# EAGLE design DMX_Eval_Board (EAGLE 9.6.2)
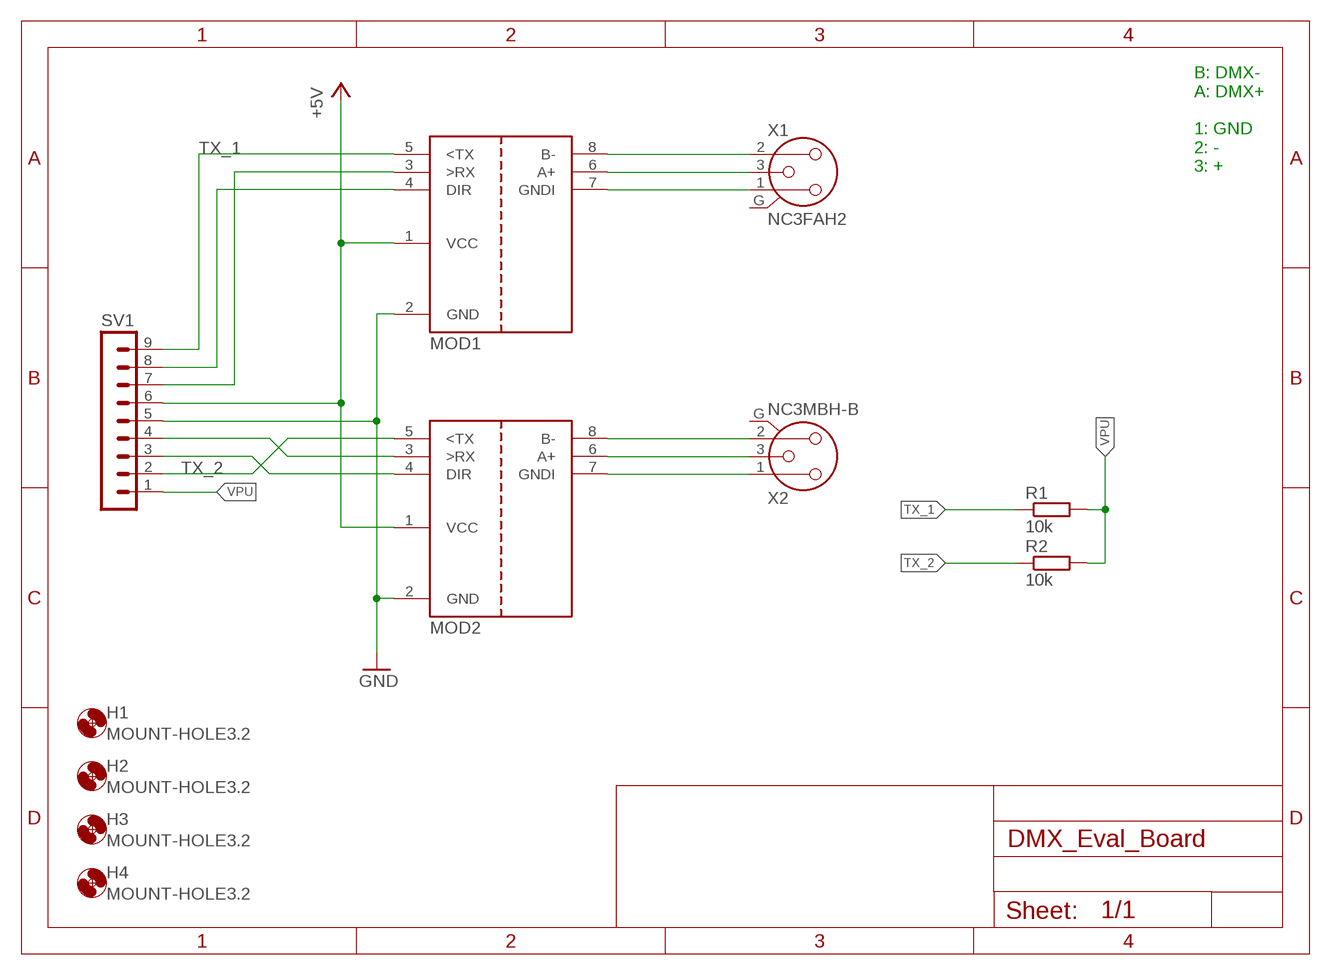
[diagram p0: schematic, sheet 1]

## Parts
H1  MOUNT-HOLE3.2  [3,2]
H2  MOUNT-HOLE3.2  [3,2]
H3  MOUNT-HOLE3.2  [3,2]
H4  MOUNT-HOLE3.2  [3,2]
MOD1  ISOL_DMX_TRANSCEIVER  [MODULE_DMX_ISO]
MOD2  ISOL_DMX_TRANSCEIVER  [MODULE_DMX_ISO]
R1  10k  R-EU_R0603  [R0603]
R2  10k  R-EU_R0603  [R0603]
SV1  MA09-1  [MA09-1]
X1  NC3FAH2  [NC3FAH2]
X2  NC3MBH-B  [NC3MBH-B]

## Nets
+5V: MOD1.1(VCC) MOD2.1(VCC) SV1.6
GND: MOD1.2(GND) MOD2.2(GND) SV1.5
N$1: MOD1.7(GNDI) X1.1
N$2: MOD2.7(GNDI) X2.1
N$3: MOD2.8(B-) X2.2
N$4: MOD2.6(A+) X2.3
N$5: MOD1.6(A+) X1.3
N$6: MOD1.8(B-) X1.2
N$8: MOD2.4(DIR) SV1.3
N$9: MOD2.3(>RX) SV1.4
N$11: MOD1.4(DIR) SV1.8
N$12: MOD1.3(>RX) SV1.7
TX_1: MOD1.5(<TX) R1.1 SV1.9
TX_2: MOD2.5(<TX) R2.1 SV1.2
VPU: R1.2 R2.2 SV1.1
Unconnected: X1.G X2.G

## Notes on the sheet
- B: DMX-
  A: DMX+
  
  1: GND
  2: -
  3: +

## Library data of the parts
H1-H4 = holes:MOUNT-HOLE: MOUNTING HOLE with drill center marker
MOD1 MOD2 = Eigene-Rietig:ISOL_DMX_TRANSCEIVER
R1 R2 = rcl:R-EU_: RESISTOR, European symbol; SPICEPREFIX: R
SV1 = con-lstb:MA09-1: PIN HEADER; OC_FARNELL: unknown; OC_NEWARK: unknown
X1 = con-neutrik_ag:NC3: Neutrik Audio Connector XLR SERIES Stereo 1/4" jack Source: www.neutrik.com/; MPN: NC3FAH2; OC_FARNELL: unknown; OC_NEWARK: 27B4208
X2 = con-neutrik_ag:NC3: Neutrik Audio Connector XLR SERIES Stereo 1/4" jack Source: www.neutrik.com/; MPN: NC3MBH-B; OC_FARNELL: unknown; OC_NEWARK: 27B4288

## Net classes
1 vcc: width 0.254 mm

## Board
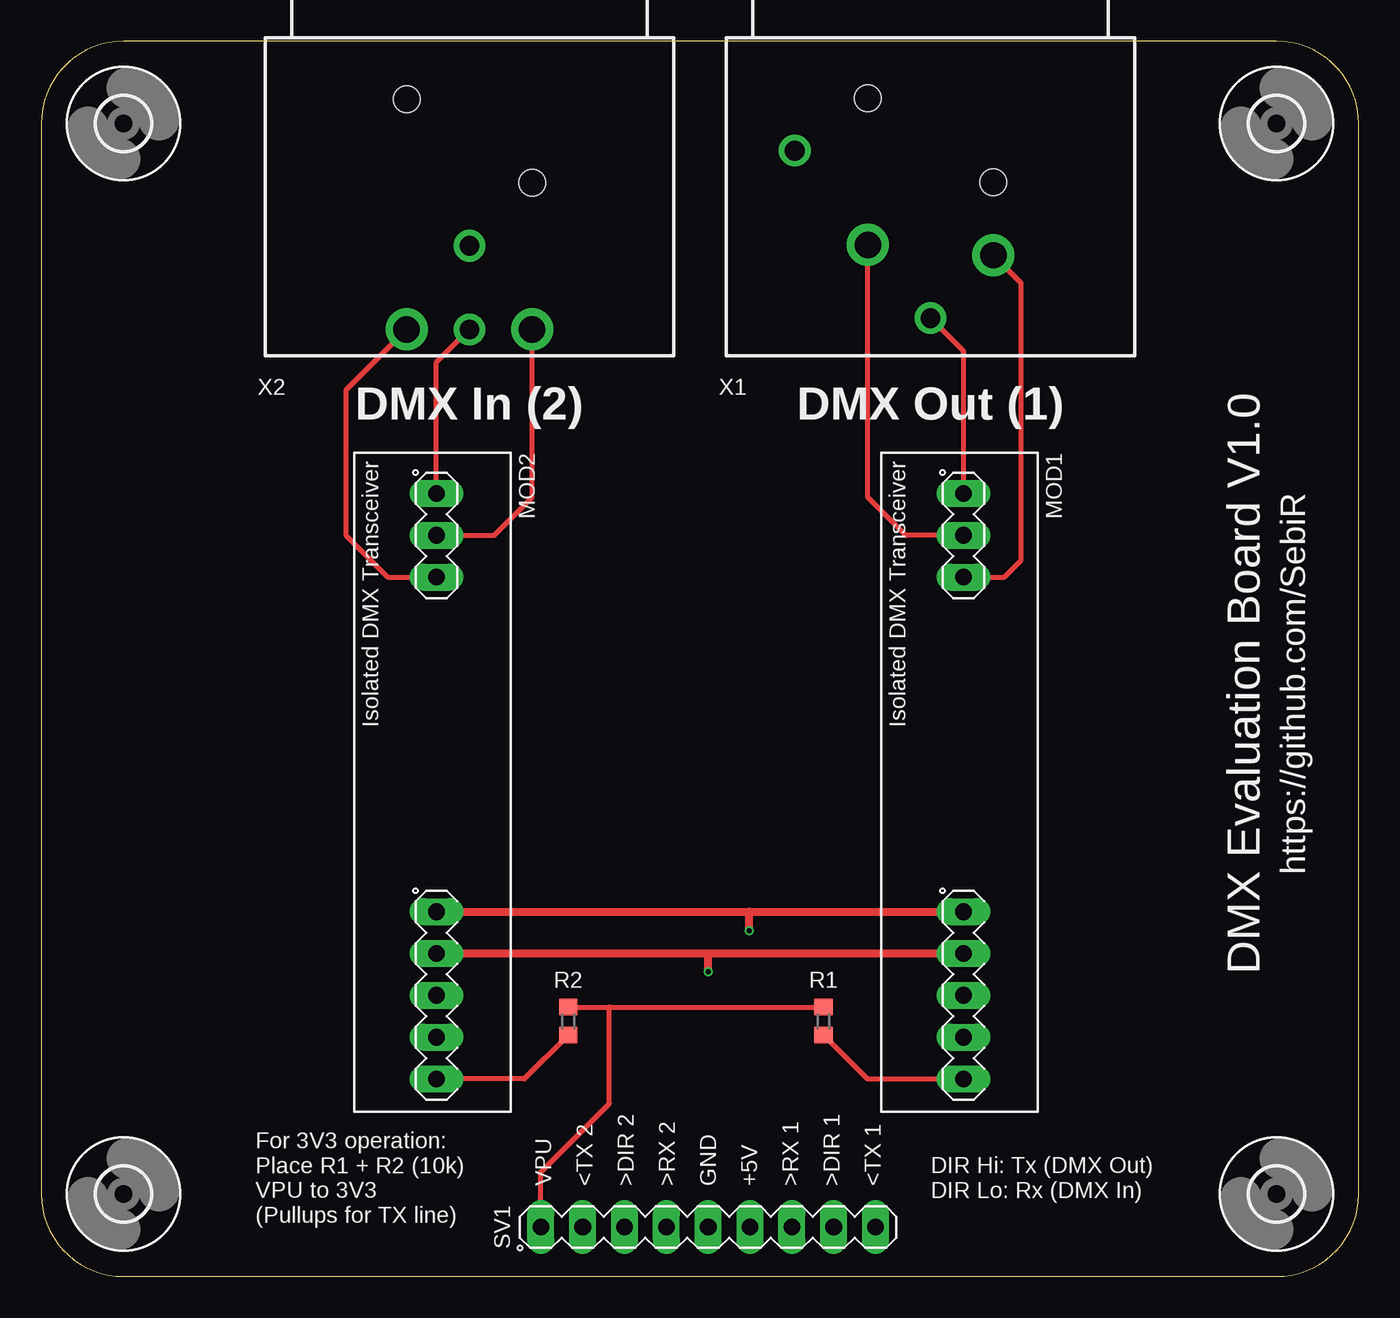
[diagram p1: board, top side]
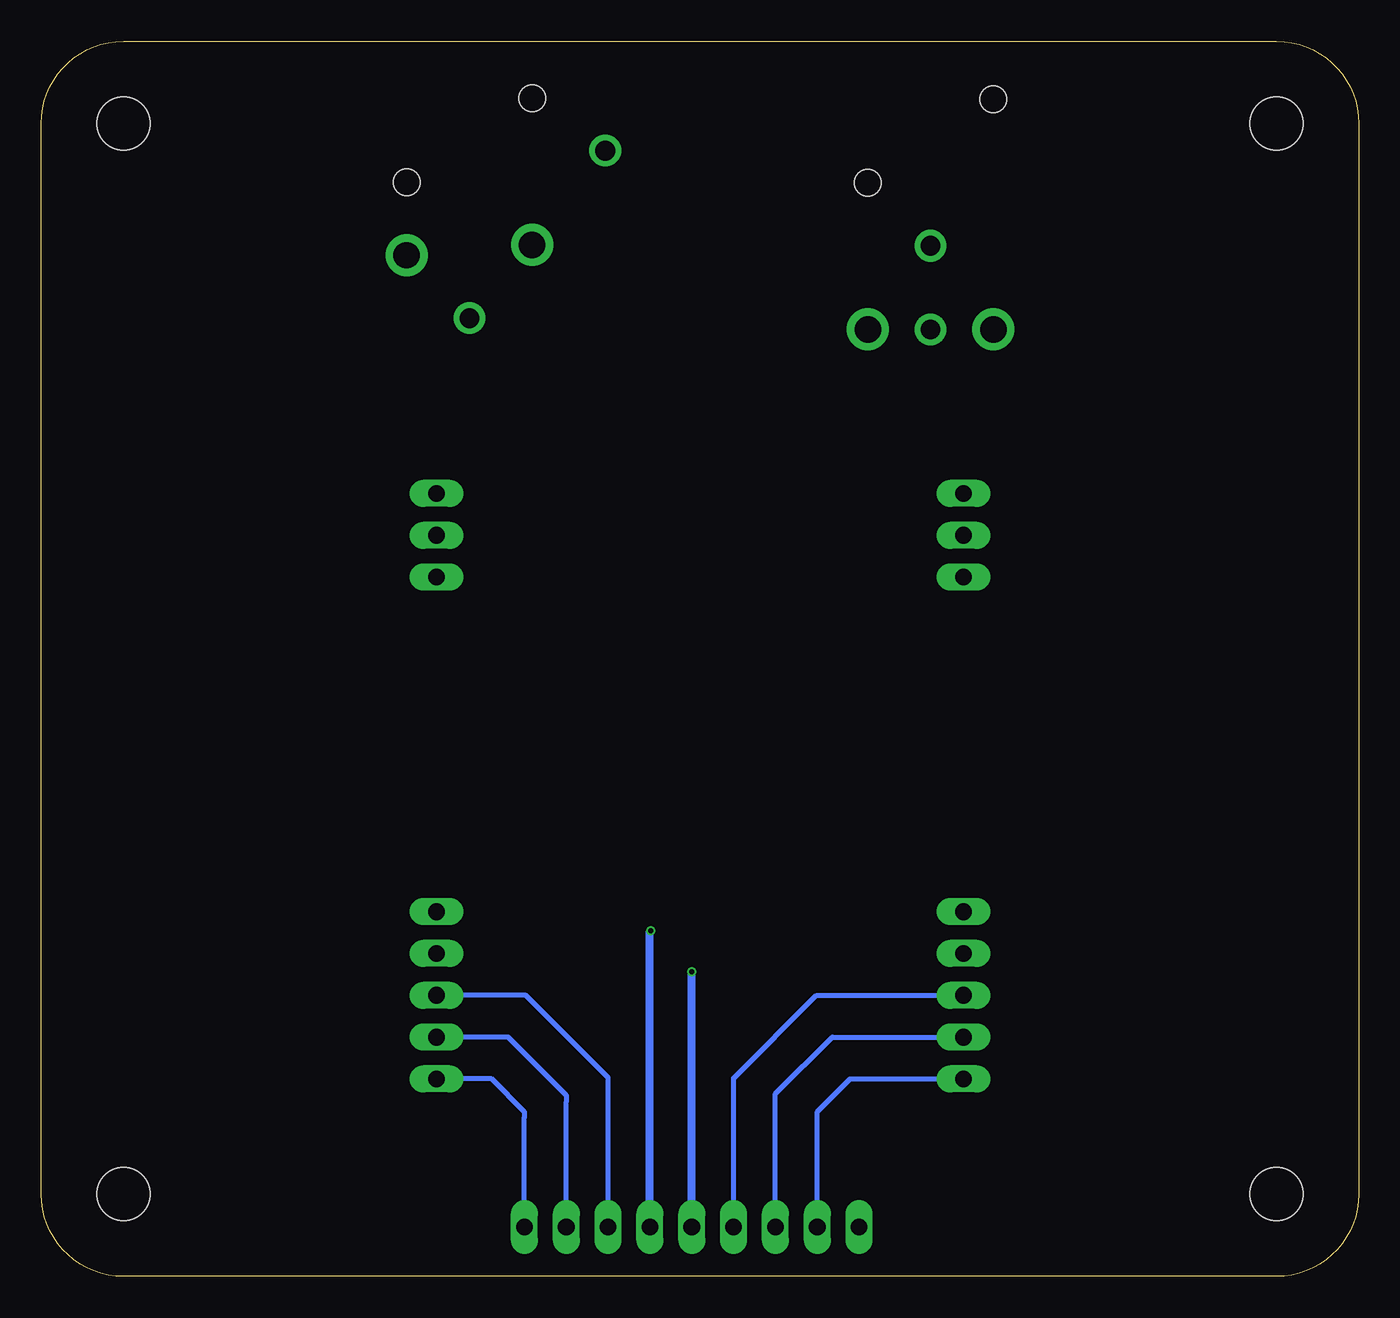
[diagram p2: board, bottom side, seen from below]

Size 80 x 75 mm. Coordinates in mm from the lower left corner, seen from the top.
Outline: 0,70 0,5 arc90 5,0 75,0 arc90 80,5 80,70 arc90 75,75 5,75 arc90 0,70
Copper layers (1*16): Top 0.035mm / dielectric 1.6mm / Bottom 0.035mm
Design rules "jlcpcb-2layers": minimum track width 0.2mm, minimum drill 0.3mm, track to track 5mil, track to pad 5mil, pad to pad 5mil, via to via 5mil, smd to smd 5mil, copper to edge 0.2mm, drill to drill 6mil, minimum pad ring 0.125mm, minimum via ring 0.125mm, stop-mask expansion 4mil, vias tented up to drill 0.5mm, thermal gap 10mil

### Footprints (pad centres in the part's own frame; a part is rotated, then mirrored left to right if it is on the bottom)
3,2 = hole 3.2: 0,0
MODULE_DMX_ISO = drill 1.016 long: 1 22.85,0; 2 25.39,0; 3 27.93,0; 4 30.47,0; 5 33.01,0; 6 -2.54,0; 7 0,0; 8 2.54,0
R0603 = smd 1 x 1.1: 1 -0.85,0; 2 0.85,0
MA09-1 = drill 1.016 long: 1 -10.16,0; 2 -7.62,0; 3 -5.08,0; 4 -2.54,0; 5 0,0; 6 2.54,0; 7 5.08,0; 8 7.62,0; 9 10.16,0
NC3FAH2 = drill 1.6: 1 -3.81,0.635; 2 3.81,0 | drill 1.2: 3 0,-3.815; G -8.25,6.355 | hole 1.6: -3.81,9.525; 3.81,4.445
NC3MBH-B = drill 1.6: 1 3.81,0; 2 -3.81,0 | drill 1.2: 3 0,0; G 0,5.08 | hole 1.6: -3.81,13.97; 3.81,8.89

### Placement (x,y rotation side)
H1  5,70 0 top
H2  75,70 0 top
H3  5,5 0 top
H4  75,5 0 top
MOD1  56,45 270 top
MOD2  24,45 270 top
R1  47.5,15.5 90 top
R2  32,15.5 90 top
SV1  40.5,3 0 top
X1  54,62 0 top
X2  26,57.5 0 top

### Tracks (layer width: path | path; a pad name or v marks a point on that pad's centre or on a via)
+5V  (via drill 0.3)
  Top 0.5: MOD2.1 43,22.15 | 43,22.15 MOD1.1 | v43,21 43,22.15
  Bottom 0.5: v43,21 43.04,20.96 SV1.6
GND  (via drill 0.3)
  Top 0.5: MOD2.2 40.5,19.61 | 40.5,19.61 MOD1.2 | v40.5,18.5 40.5,19.61
  Bottom 0.5: SV1.5 v40.5,18.5
N$1
  Top 0.3: MOD1.7 52.5,45 50.19,47.31 X1.1
N$2
  Top 0.3: MOD2.7 27.5,45 29.81,47.31 X2.1
N$3
  Top 0.3: X2.2 18.5,53.81 18.5,45 21.04,42.46 MOD2.8
N$4
  Top 0.3: MOD2.6 24,55.5 X2.3
N$5
  Top 0.3: MOD1.6 56,56.19 X1.3
N$6
  Top 0.3: MOD1.8 58.46,42.46 59.5,43.5 59.5,60.31 X1.2
N$8
  Bottom 0.3: SV1.3 35.42,11.08 31.97,14.53 MOD2.4
N$9
  Bottom 0.3: SV1.4 37.96,12.04 32.93,17.07 MOD2.3
N$11
  Bottom 0.3: SV1.8 48.12,10.62 48.12,11 51.65,14.53 MOD1.4
N$12
  Bottom 0.3: SV1.7 45.58,12.08 50.57,17.07 MOD1.3
TX_1
  Top 0.3: MOD1.5 50.16,11.99 R1.1
  Bottom 0.3: SV1.9 50.66,9.66 50.66,10 52.65,11.99 MOD1.5
TX_2
  Top 0.3: R2.1 29.34,11.99 MOD2.5
  Bottom 0.3: SV1.2 32.88,10 30.89,11.99 MOD2.5
VPU
  Top 0.3: R2.2 34.5,16.35 | 34.5,16.35 R1.2 | SV1.1 30.34,6.34 34.5,10.5 34.5,16.35

### Text on the board
tPlace: DMX In (2) | DMX Out (1) | DMX Evaluation Board V1.0 | https://github.com/SebiR | For 3V3 operation: / Place R1 + R2 (10k) / VPU to 3V3 / (Pullups for TX line) | VPU | <TX 2 | >DIR 2 | >RX 2 | GND | +5V | >RX 1 | >DIR 1 | <TX 1 | DIR Hi: Tx (DMX Out) / DIR Lo: Rx (DMX In)